# Altium project UD-CPU_DIN_v2.PrjPcb
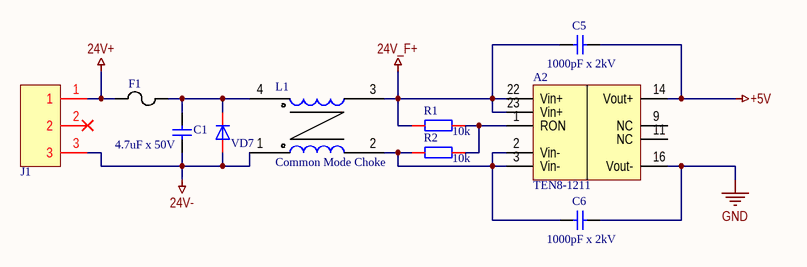
[diagram p0: CPU_DIN_mainboard_v2.SchDoc]
1 sheet, 10 parts. Net scope: global (net labels, ports and power ports of the same name join across sheets).

## Sheet CPU_DIN_mainboard_v2.SchDoc
size 420 x 297 mm; Address1: Address1; Address2: Address2; Address3: Address3; Address4: Address4; DocumentNumber: АБВГ.123456.001 Э3; SheetNumber: 1; SheetTotal: 1; Scale: 1:1; DocumentType: Схема электрическая принципиальная; FirstReferrence: АБВГ.123456.001

### Parts
A2  TEN8-1211  [dcdc_ten8-1211]
C1  4.7uF x 50V  [C1206]
C5  1000pF x 2kV  [c1206]
C6  1000pF x 2kV  [c1206]
F1  FUSE  [MF-SM100]  (value not drawn)
J1  Terminal block TB-3  [TB-3_ser370]  (value not drawn)
L1  Common Mode Choke  [TCK-050]
R1  10k  [R0805]
R2  10k  [R0805]
VD7  15MQ040N  [SMA DIOD]  (value not drawn)

### Nets
24V+: F1.1 J1.1
24V-: C1.2 J1.3 L1.1 VD7.A
24V_F+: A2.22(Vin+) A2.23(Vin+) C5.1 L1.3 R1.2
+5V: A2.14(Vout+) C5.2
GND: A2.16(Vout-) C6.2
NetA2_1: A2.1(RON) R1.1 R2.1
NetA2_2: A2.2(Vin-) A2.3(Vin-) C6.1 L1.2 R2.2
NetC1_1: C1.1 F1.2 L1.4 VD7.K

Not connected (* = marked no-connect by the designer): A2 9(NC) 11(NC); J1 2*

### Notes on the sheet
- Перв. примен.
- Справ. №
- Подп. и дата
- Инв. № дубл.
- Взам. инв. №
- Разраб.
- Изм.
- Лист
- № докум.
- Подп.
- Дата
- Лит.
- Масса
- Масштаб
- Пров.
- Т.контр.
- Листов
- Инв. № подл.
- Утв.
- Н.контр.
- 2.106-A3
- Копировал
- Формат А3

### Library data of the parts
A2 = TEN8-1211: Traco Isolated DC/DC; partnum: TEN8-1211
C1 = CAP_SMD: partnum: GRM31CR71H475KA12L; value: 4.7uF x 50V
C5 C6 = CAP_SMD: value: 1000pF x 2kV
F1 = FUSE: partnum: MF-SM100-2
J1 = TB-3
L1 = L_CHOKE: partnum: TCK-050
R1 R2 = RES_SMD: value: 10k
VD7 = DIOD: partnum: VS-15MQ040NTRPBF; value: 15MQ040N